# EAGLE schematic RocketControlver.1(broken) (EAGLE 9.6.2)
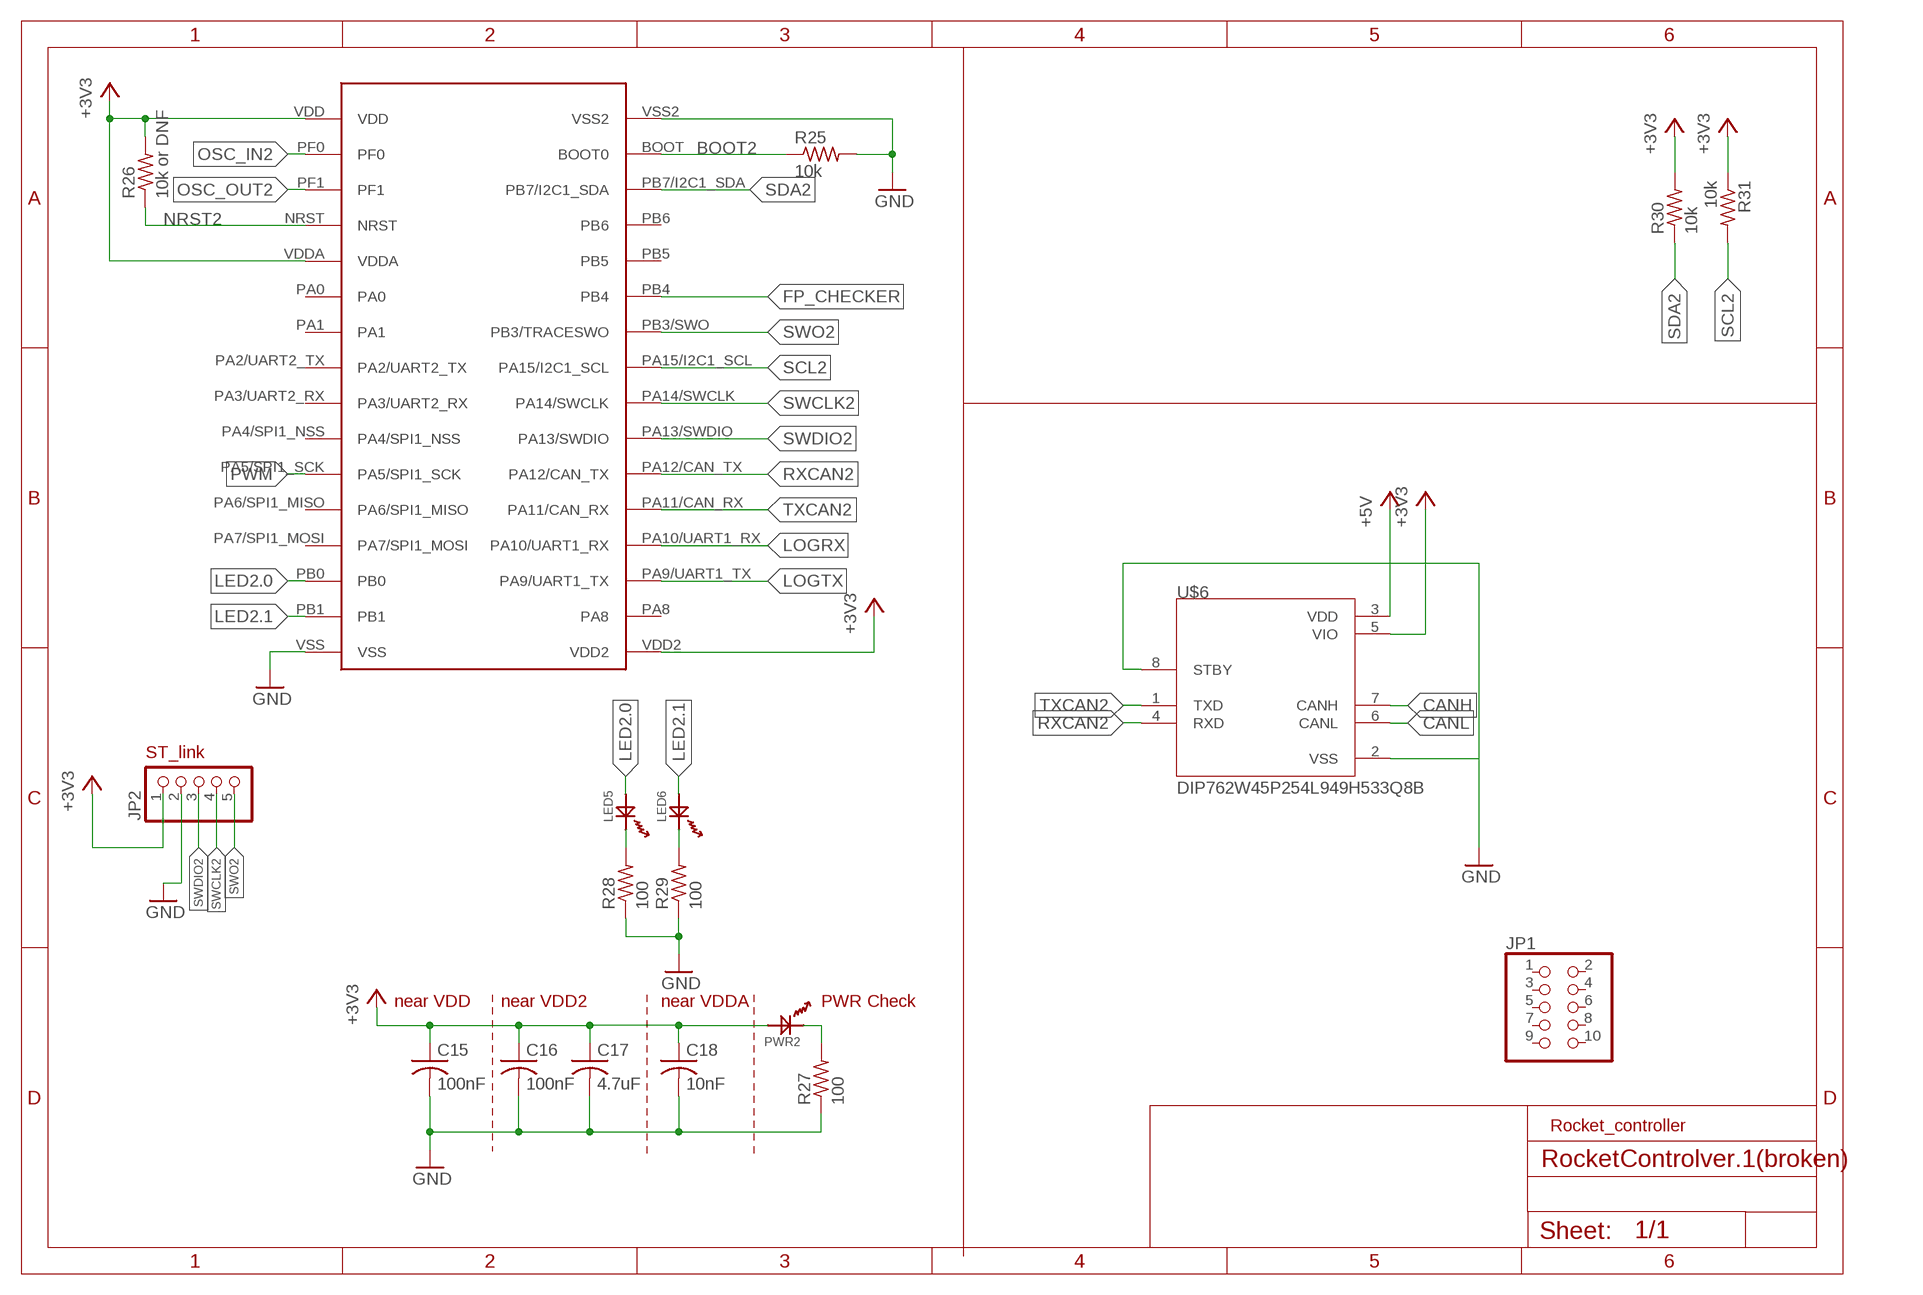
[diagram p0: schematic, sheet 1]

## Parts
C15  100nF  C-USC1608  [C1608]
C16  100nF  C-USC1608  [C1608]
C17  4.7uF  C-USC1608  [C1608]
C18  10nF  C-USC1608  [C1608]
JP1  PINHD-2X5/90  [2X05/90]
JP2  PINHD-1X5/90  [1X05/90]
LED5  OSXX1608C1A  [OSXX1608C1A]
LED6  OSXX1608C1A  [OSXX1608C1A]
PWR2  OSXX1608C1A  [OSXX1608C1A]
R25  10k  R-US_R0603  [R0603]
R26  10k or DNF  R-US_R0603  [R0603]
R27  100  R-US_R0603  [R0603]
R28  100  R-US_R0603  [R0603]
R29  100  R-US_R0603  [R0603]
R30  10k  R-US_R0603  [R0603]
R31  10k  R-US_R0603  [R0603]
U$1  STM32F303K8  [STM32F303K8]
U$6  DIP762W45P254L949H533Q8B  [DIP762W45P254L949H533Q8B]

## Nets
+3V3: C15.1 C16.1 C17.1 C18.1 JP2.1 PWR2.AN R26.2 R30.2 R31.1 U$1.VDD U$1.VDD2 U$1.VDDA U$6.5(VIO)
+5V: U$6.3(VDD)
BOOT2: R25.1 U$1.BOOT(BOOT0)
CANH: U$6.7(CANH)
CANL: U$6.6(CANL)
FP_CHECKER: U$1.PB4
GND [im]: C15.2 C16.2 C17.2 C18.2 JP2.2 R25.2 R27.1 R28.1 R29.1 U$1.VSS U$1.VSS2 U$6.2(VSS) U$6.8(STBY)
LED2.0: LED5.AN U$1.PB0
LED2.1: LED6.AN U$1.PB1
LOGRX: U$1.PA10/UART1_RX
LOGTX: U$1.PA9/UART1_TX
N$11: PWR2.CT R27.2
N$19: LED5.CT R28.2
N$20: LED6.CT R29.2
NRST2: R26.1 U$1.NRST
OSC_IN2: U$1.PF0
OSC_OUT2: U$1.PF1
PWM: U$1.PA5/SPI1_SCK
RXCAN2: U$1.PA12/CAN_TX U$6.4(RXD)
SCL2: R31.2 U$1.PA15/I2C1_SCL
SDA2: R30.1 U$1.PB7/I2C1_SDA
SWCLK2: JP2.4 U$1.PA14/SWCLK
SWDIO2: JP2.3 U$1.PA13/SWDIO
SWO2: JP2.5 U$1.PB3/SWO(PB3/TRACESWO)
TXCAN2: U$1.PA11/CAN_RX U$6.1(TXD)
Unconnected: JP1.1 JP1.2 JP1.3 JP1.4 JP1.5 JP1.6 JP1.7 JP1.8 JP1.9 JP1.10 U$1.PA0 U$1.PA1 U$1.PA2/UART2_TX U$1.PA3/UART2_RX U$1.PA4/SPI1_NSS U$1.PA6/SPI1_MISO U$1.PA7/SPI1_MOSI U$1.PA8 U$1.PB5 U$1.PB6

## Notes on the sheet
- ST_link
- near VDD | near VDD2 | near VDDA | PWR Check
- Rocket_controller

## Library data of the parts
C15-C18 = rcl:C-US: CAPACITOR, American symbol; SPICEPREFIX: C
JP1 = pinhead:PINHD-2X5: PIN HEADER
JP2 = pinhead:PINHD-1X5: PIN HEADER
LED5 LED6 PWR2 = Chip LED:OSXX1608C1A
R25-R31 = rcl:R-US_: RESISTOR, American symbol; SPICEPREFIX: R
U$1 = STM32F303K8:STM32F303K8
U$6 = MCP2562-E_P:DIP762W45P254L949H533Q8B

## Net classes
0 default: width 0.406 mm